# EAGLE design Smart_Lights_X1 (EAGLE 9.5.1)
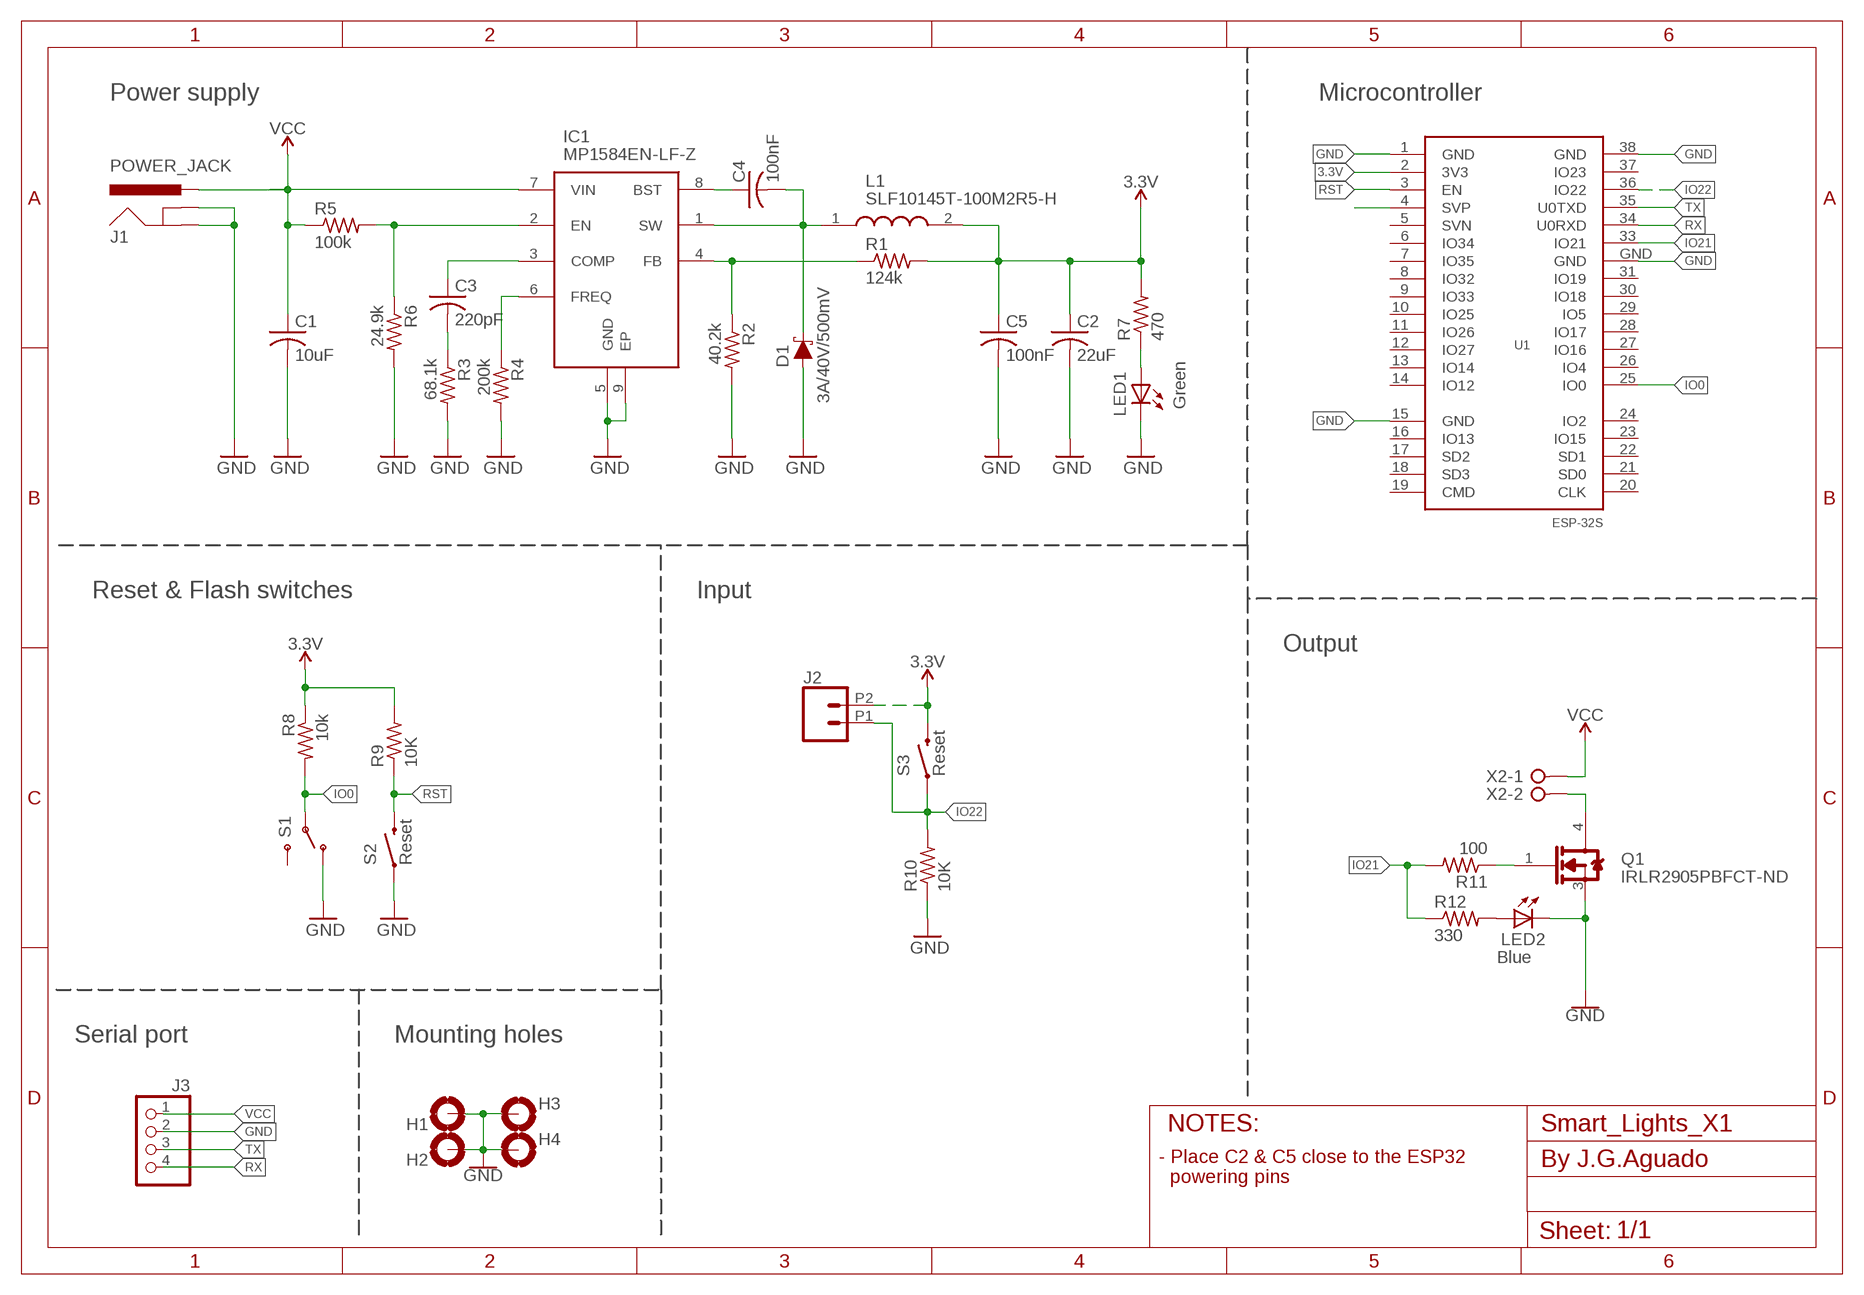
[diagram p0: schematic, sheet 1]

## Parts
C1  10uF  C-USC1206  [C1206]
C2  22uF  C-USC1206  [C1206]
C3  220pF  C-USC1206  [C1206]
C4  100nF  C-USC1206  [C1206]
C5  100nF  C-USC1206  [C1206]
D1  3A/40V/500mV  DIODE-SCHOTTKY-B340A  [SMA-DIODE]
H1  MOUNT-PAD-ROUND  [3,0-PAD]
H2  MOUNT-PAD-ROUND  [3,0-PAD]
H3  MOUNT-PAD-ROUND  [3,0-PAD]
H4  MOUNT-PAD-ROUND  [3,0-PAD]
IC1  MP1584EN-LF-Z  [SOIC127P600X170-9N]
J1  POWER_JACK  [POWER_JACK_PTH]
J2  CONN_022.54MM_SCREWTERM  [1X02_2.54_SCREWTERM]
J3  PINHD-1X4  [1X04]
L1  SLF10145T-100M2R5-H  [SLF10145]
LED1  Green  LED1206  [LED1206]
LED2  Blue  LED1206  [LED1206]
Q1  IRLR2905TRPBF  INFINEON_TECHNOLOGIES_IRLR2905TRPBFINFINEON_TECHNOLOGIES_IRLR2905TRPBF_0_0  [INFINEON_TECHNOLOGIES_IRLR2905TRPBF_0]
R1  124k  R-US_M1206  [M1206]
R2  40.2k  R-US_M1206  [M1206]
R3  68.1k  R-US_M1206  [M1206]
R4  200k  R-US_M1206  [M1206]
R5  100k  R-US_M1206  [M1206]
R6  24.9k  R-US_M1206  [M1206]
R7  470  R-US_M1206  [M1206]
R8  10k  R-US_M1206  [M1206]
R9  10K  R-US_M1206  [M1206]
R10  10K  R-US_M1206  [M1206]
R11  100  R-US_M1206  [M1206]
R12  330  R-US_M1206  [M1206]
S1  SWITCH_SPDT  [KPS-1290]
S2  Reset  SWITCH-MOMENTARY-2SMD-4  [TACTILE_SWITCH_TALL]
S3  Reset  SWITCH-MOMENTARY-2SMD-4  [TACTILE_SWITCH_TALL]
U1  ESP-32S  [ESP-32S]
X2  W237-02P  [W237-132]

## Nets
3.3V: C2.1 C5.1 J2.P2 L1.2 R1.2 R7.2 R8.1 R9.2 S3.B2 U1.2(3V3)
GND: C1.2 C2.2 C5.2 D1.A H1.B3,0(MOUNT) H1.P$2(MOUNT) H1.P$3(MOUNT) H1.P$4(MOUNT) H1.P$5(MOUNT) H1.P$6(MOUNT) H1.P$7(MOUNT) H1.P$8(MOUNT) H1.P$9(MOUNT) H2.B3,0(MOUNT) H2.P$2(MOUNT) H2.P$3(MOUNT) H2.P$4(MOUNT) H2.P$5(MOUNT) H2.P$6(MOUNT) H2.P$7(MOUNT) H2.P$8(MOUNT) H2.P$9(MOUNT) H3.B3,0(MOUNT) H3.P$2(MOUNT) H3.P$3(MOUNT) H3.P$4(MOUNT) H3.P$5(MOUNT) H3.P$6(MOUNT) H3.P$7(MOUNT) H3.P$8(MOUNT) H3.P$9(MOUNT) H4.B3,0(MOUNT) H4.P$2(MOUNT) H4.P$3(MOUNT) H4.P$4(MOUNT) H4.P$5(MOUNT) H4.P$6(MOUNT) H4.P$7(MOUNT) H4.P$8(MOUNT) H4.P$9(MOUNT) IC1.5(GND) IC1.9(EP) J1.GND J1.GNDBREAK J3.2 LED1.C LED2.C Q1.3(SOURCE) R2.2 R3.2 R4.2 R6.2 R10.1 S1.O S2.A2 U1.1(GND) U1.15(GND) U1.38(GND) U1.GND
IN_5: U1.4(SVP)
IO0: R8.2 S1.P U1.25(IO0)
IO21: R11.2 R12.1 U1.33(IO21)
IO22: J2.P1 R10.2 S3.A2 U1.36(IO22)
N$1: C4.1 IC1.8(BST)
N$2: C4.2 D1.C IC1.1(SW) L1.1
N$4: Q1.4(DRAIN) X2.2
N$5: Q1.1(GATE) R11.1
N$6: IC1.4(FB) R1.1 R2.1
N$7: C3.2 R3.1
N$8: C3.1 IC1.3(COMP)
N$12: IC1.6(FREQ) R4.1
N$13: IC1.2(EN) R5.2 R6.1
N$15: LED1.A R7.1
N$17: LED2.A R12.2
RST: R9.1 S2.B2 U1.3(EN)
RX: J3.4 U1.34(U0RXD)
TX: J3.3 U1.35(U0TXD)
VCC: C1.1 IC1.7(VIN) J1.PWR J3.1 R5.1 X2.1
Unconnected: S1.S U1.5(SVN) U1.6(IO34) U1.7(IO35) U1.8(IO32) U1.9(IO33) U1.10(IO25) U1.11(IO26) U1.12(IO27) U1.13(IO14) U1.14(IO12) U1.16(IO13) U1.17(SD2) U1.18(SD3) U1.19(CMD) U1.20(CLK) U1.21(SD0) U1.22(SD1) U1.23(IO15) U1.24(IO2) U1.26(IO4) U1.27(IO16) U1.28(IO17) U1.29(IO5) U1.30(IO18) U1.31(IO19) U1.37(IO23)

## Notes on the sheet
- Power supply | Microcontroller
- Reset & Flash switches | Input
- Output
- Serial port | Mounting holes
- - Place C2 & C5 close to the ESP32
    powering pins

## Library data of the parts
C1-C5 = rcl:C-US: CAPACITOR, American symbol; SPICEPREFIX: C
D1 = SparkFun-DiscreteSemi:DIODE-SCHOTTKY: Schottky diode A Schottky diode is a semiconductor diode which has a low forward voltage drop and a very fast switching action.; PROD_ID: DIO-09886
H1-H4 = SpaceDIY_connectors:MOUNT-PAD-ROUND: MOUNTING PAD, round
IC1 = SamacSys_Parts:MP1584EN-LF-Z: Switching Voltage Regulators 3A 1.5MHz 28V Nonsync Buck Source: Datasheet <https://componentsearchengine.com/Datasheets/1/MP1584EN-LF-Z.pdf>; DESCRIPTION: Switching Voltage Regulators 3A 1.5MHz 28V Nonsync Buck; HEIGHT: 1.7mm; MANUFACTURER_NAME: Monolithic Power Systems (MPS); MANUFACTURER_PART_NUMBER: MP1584EN-LF-Z; MOUSER_PART_NUMBER: 946-MP1584ENLFZ; MOUSER_PRICE-STOCK: https://www.mouser.co.uk/ProductDetail/Monolithic-Power-Systems-MPS/MP1584EN-LF-Z?qs=rC7bBWoQAAktQUA%2FYI26vA%3D%3D
J1 = SparkFun-Connectors:POWER_JACK: Power Jack Connector This is the standard 5.5mm barrel jack for power. The PTH is the most common, proven, reliable, footprint. The Slot footprint only works if the mill layer is transmitted to the PCB fab house so be warned. Here are the connectors we sell at SparkFun: DC Barrel Power Jack/Connector <https://www.sparkfun.com/products/119> (PRT-00119) DC Barrel Power Jack/Connector (SMD) <https://www.sparkfun.com/products/12748> (PRT-12748) DC Barrel Jack Adapter - Breadboard Compatible <https://www.sparkfun.com/products/10811> (PRT-10811) It is used on this SparkFun product (and many, many others): SparkFun RedBoard - Programmed with Arduino <https://www.sparkfun.com/products/12757> (DEV-12757) Also, if you need a mating power supply or connector, please check these out: Wall Adapter Power Supply - 9VDC 650mA <https://www.sparkfun.com/products/298> (TOL-00298) DC Barrel Jack Adapter - Male <https://www.sparkfun.com/products/10287> (PRT-10287); PROD_ID: CONN-08197
J2 = SparkFun-Connectors:CONN_02: Multi connection point. Often used as Generic Header-pin footprint for 0.1 inch spaced/style header connections On any of the 0.1 inch spaced packages, you can populate with these: Break Away Headers - Straight <https://www.sparkfun.com/products/116> (PRT-00116) Break Away Male Headers - Right Angle <https://www.sparkfun.com/products/553> (PRT-00553) Female Headers <https://www.sparkfun.com/products/115> (PRT-00115) Break Away Headers - Machine Pin <https://www.sparkfun.com/products/117> (PRT-00117) Break Away Female Headers - Swiss Machine Pin <https://www.sparkfun.com/products/743> (PRT-00743) For SCREWTERMINALS and SPRING TERMINALS visit here: Screw Terimnals on SparkFun.com <https://www.sparkfun.com/search/results?term=Screw+Terminals> (5mm/3.5mm/2.54mm spacing) This device is also useful as a general connection point to wire up your design to another part of your project. Our various solder wires solder well into these plated through hole pads. Hook-Up Wire - Assortment (Stranded, 22 AWG) <https://www.sparkfun.com/products/11375> (PRT-11375) Hook-Up Wire - Assortment (Solid Core, 22 AWG) <https://www.sparkfun.com/products/11367> (PRT-11367) View the entire wire category on our website here <https://www.sparkfun.com/categories/141> Special notes: Molex polarized connector foot print use with: PRT-08233 with associated crimp pins and housings. 2.54_SCREWTERM for use with PRT-10571. 3.5mm Screw Terminal footprints for PRT-08084 5mm Screw Terminal footprints for use with PRT-08432
J3 = pinhead:PINHD-1X4: PIN HEADER
L1 = SamacSys_Parts:SLF10145T-100M2R5-H: Inductors for power circuits, Wound ferrite, Automotive Source: Datasheet <https://product.tdk.com/system/files/dam/doc/product/inductor/inductor/smd/catalog/inductor_automotive_power_slf10145-h_en.pdf>; DESCRIPTION: Inductors for power circuits, Wound ferrite, Automotive; HEIGHT: mm; MANUFACTURER_NAME: TDK; MANUFACTURER_PART_NUMBER: SLF10145T-100M2R5-H; MOUSER_PART_NUMBER: 810-SLF10145T100M2R5; MOUSER_PRICE-STOCK: https://www.mouser.co.uk/ProductDetail/TDK/SLF10145T-100M2R5-H?qs=Ydpp5fRLlSHtCO7lbZYIxA%3D%3D
LED1 LED2 = SpaceDIY_passive_components:LED1206
Q1 = Infineon Technologies - IRLR2905TRPBF:INFINEON_TECHNOLOGIES_IRLR2905TRPBF: MOSFET N-CH 55V 42A DPAK; AUTOMOTIVE: No; CENTROID_NOT_SPECIFIED: Yes; CONTINUOUS_DRAIN_CURRENT: 42A; DATASHEET: https://www.infineon.com/dgdl/irlr2905pbf.pdf?fileId=5546d462533600a40153566cc2bb2679; DEPLETION_MODE: False; DEVICE_CLASS_L1: Discrete Semiconductors; DEVICE_CLASS_L2: Transistors; DEVICE_CLASS_L3: MOSFETs; DIGIKEY_DESCRIPTION: TRANS MOSFET N-CH 55V 42A DPAK; DIGIKEY_PART_NUMBER: IRLR2905PBFCT-ND; DRAIN_TO_SOURCE_BREAKDOWN_VOLTAGE: 55V; DRAIN_TO_SOURCE_RESISTANCE: 0.03Ω; DRAIN_TO_SOURCE_VOLTAGE: 55V; FOOTPRINT_URL: http://www.irf.com/package/hexfet/dpakfootprint.pdf; FOOTPRINT_VARIANT_NAME_0: Recommended_Land_Pattern; GATE_CHARGE_AT_VGS: 48nC @ 5V; GATE_TO_SOURCE_VOLTAGE: 16V; HEIGHT: 2.52mm; INPUT_CAPACITACE_AT_VDS: 1700pF @ 25V; LEAD_FREE: Yes; MAX_FORWARD_DIODE_VOLTAGE: 1.3V; MAX_JUNCTION_TEMP: +175°C; MF: Infineon Technologies; MFG_PACKAGE_IDENT: PG-TO252-3; MFG_PACKAGE_IDENT_DATE: 0; MFG_PACKAGE_IDENT_REV: 901; MOUSER_PART_NUMBER: 942-IRLR2905TRPBF; MPN: IRLR2905TRPBF; NUMBER_OF_CHANNELS: 1; NUMBER_OF_N_CHANNELS: 1; PACKAGE: D-Pak; POWER_DISSIPATION: 110W; PREFIX: Q; PULSE_DRAIN_CURRENT: 160A; REVERSE_RECOVERY_CHARGE: 210nC; REVERSE_RECOVERY_TIME: 80ns; ROHS: Yes; RTHJA_MAX: 110°C/W; TEMPERATURE_RANGE_HIGH: +175°C; TEMPERATURE_RANGE_LOW: -55°C; THRESHOLD_VGS_MAX: 2V; THRESHOLD_VGS_MIN: 1V; TURN_OFF_DELAY_TIME: 26ns; TURN_ON_DELAY_TIME: 11ns; VERIFICATION_VERSION: 0.0.0.3
R1-R12 = rcl:R-US_: RESISTOR, American symbol; SPICEPREFIX: R
S1 = SparkFun-Retired:SWITCH_SPDT: SWCH-10651 Side-actuated SPDT slide switch, as used on the Arduino Pro; PROD_ID: SWCH-10651
S2 S3 = Testing:SWITCH-MOMENTARY-2: Various NO switches- pushbuttons, reed, etc
U1 = esp32:ESP-32S: Ai-Thinker ESP-32S
X2 = con-wago-508:W237-02P: WAGO SREW CLAMP; OC_FARNELL: unknown; OC_NEWARK: unknown

## Net classes
0 default: clearance 0.205 mm
2 analog: width 0.203 mm, drill 0.33 mm, clearance 0.152 mm

## Board
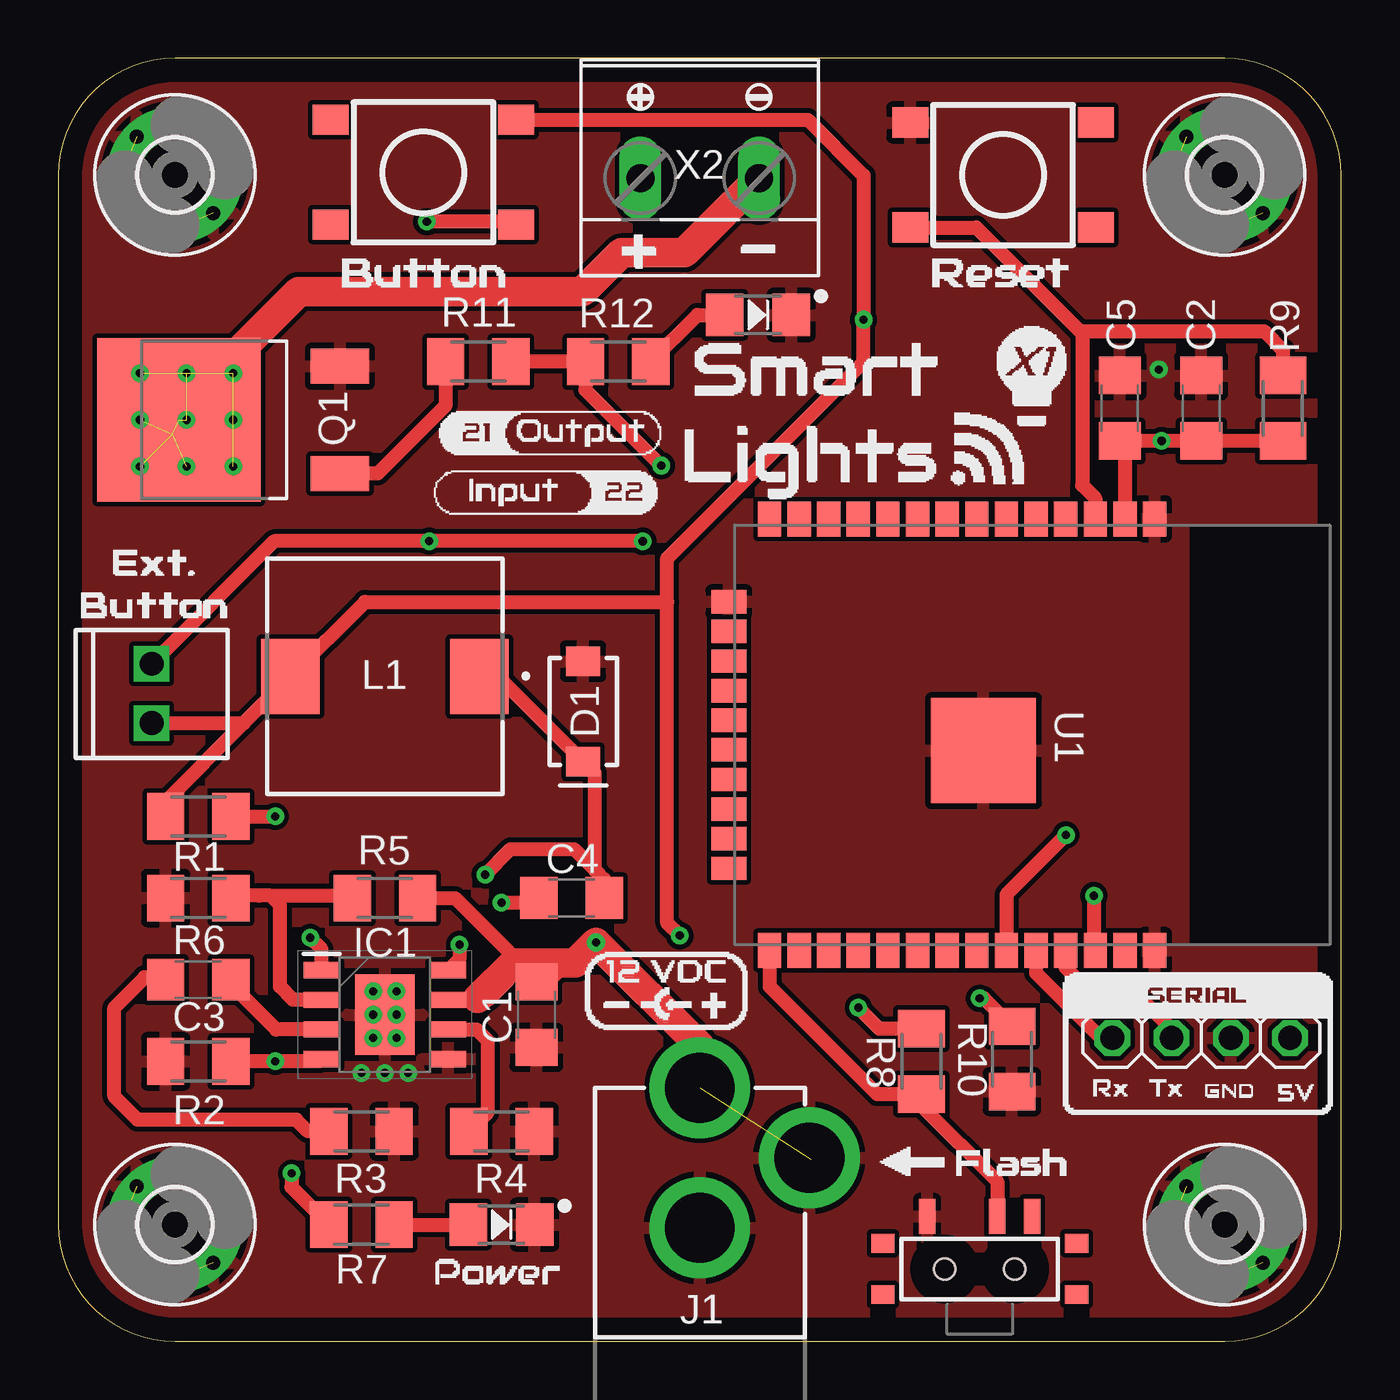
[diagram p1: board, top side]
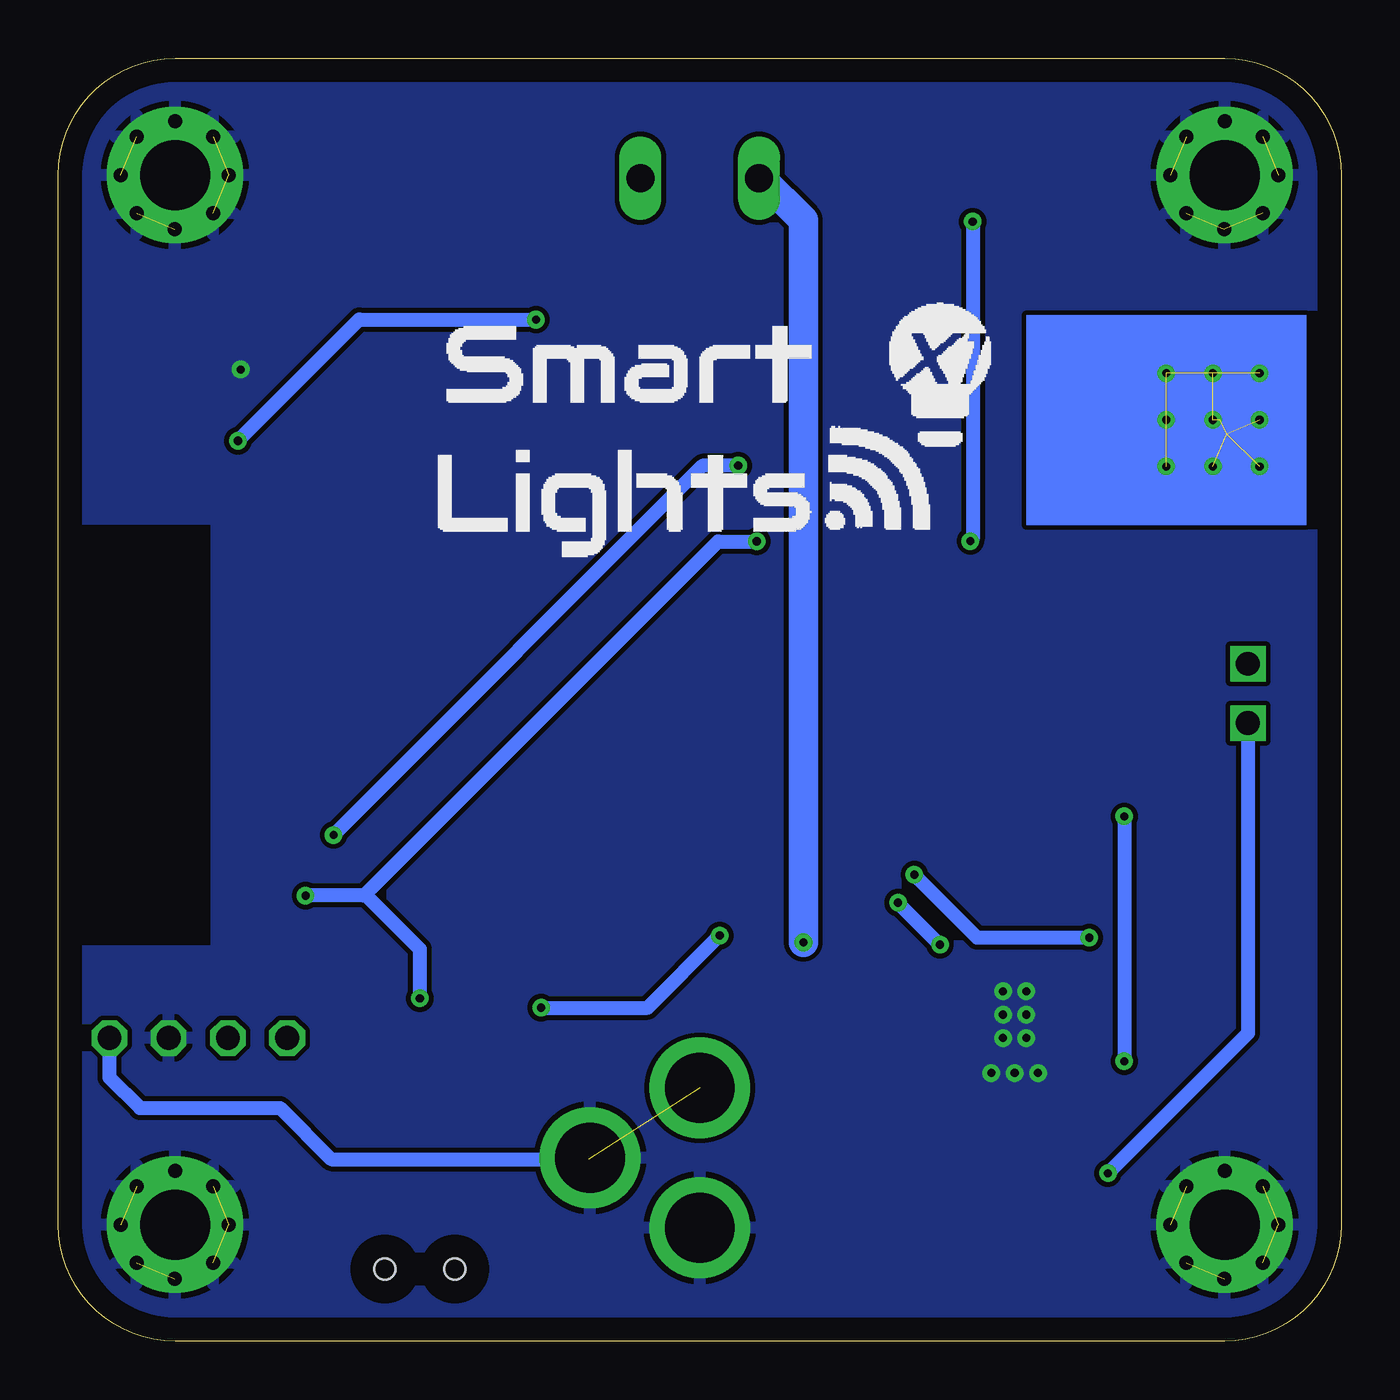
[diagram p2: board, bottom side, seen from below]

Size 55 x 55 mm. Coordinates in mm from the lower left corner, seen from the top.
Outline: 0,5 arc90 5,0 50,0 arc90 55,5 55,50 arc90 50,55 5,55 arc90 0,50 0,5
Copper layers (1*16): Top 0.035mm / dielectric 1.5mm / Bottom 0.035mm
Design rules "default": minimum track width 6mil, minimum drill 0.35mm, track to track 6mil, track to pad 6mil, pad to pad 6mil, via to via 6mil, smd to smd 6mil, copper to edge 40mil, drill to drill 6mil, minimum pad ring 10mil, minimum via ring 8mil, stop-mask expansion 4mil, vias tented up to drill 0mil, thermal gap 10mil

### Footprints (pad centres in the part's own frame; a part is rotated, then mirrored left to right if it is on the bottom)
C1206 = smd 1.6 x 1.8: 1 -1.4,0; 2 1.4,0
SMA-DIODE = smd 1.27 x 1.47: A -2.15,0; C 2.15,0
3,0-PAD = drill 3 pad 5.842: B3,0 0,0 | drill 0.6: P$2 0,2.31; P$3 1.638,1.634; P$4 2.318,-0.003; P$5 1.642,-1.64; P$6 0.005,-2.32; P$7 -1.633,-1.644; P$8 -2.313,-0.008; P$9 -1.636,1.63
SOIC127P600X170-9N = smd 1.525 x 0.7: 1 -2.712,1.905; 2 -2.712,0.635; 3 -2.712,-0.635; 4 -2.712,-1.905; 5 2.712,-1.905; 6 2.712,-0.635; 7 2.712,0.635; 8 2.712,1.905 | smd 2.56 x 3.45: 9 0,0
POWER_JACK_PTH = drill 2.997 pad 4.318: GND 0,7.7; GNDBREAK 4.7,10.7; PWR 0,13.7
1X02_2.54_SCREWTERM = drill 1.016 square: P1 2.54,0; P2 0,0
1X04 = drill 1.016 octagon: 1 -3.81,0; 2 -1.27,0; 3 1.27,0; 4 3.81,0
SLF10145 = smd 2.5 x 3.2: 1 -4.05,0; 2 4.05,0
LED1206 = smd 1.6 x 1.803: A -1.422,0; C 1.422,0
INFINEON_TECHNOLOGIES_IRLR2905TRPBF_0 = smd 1.5 x 2.5: 1 -2.3,-4.575; 3 2.3,-4.575 | smd 7 x 7: 4 0,2.325
M1206 = smd 1.6 x 2: 1 -1.4,0; 2 1.4,0
KPS-1290 = smd 0.7 x 1.5: O -2.25,2.25; P 0.75,2.25; S 2.25,2.25 | smd 1 x 0.8: P$1 -4.15,1.1; P$2 -4.15,-1.1; P$3 4.15,-1.1; P$4 4.15,1.1 | hole 0.9: -1.5,0; 1.5,0
TACTILE_SWITCH_TALL = smd 1.55 x 1.3: A1 -3.975,-2.25; A2 3.975,-2.25; B1 -3.975,2.25; B2 3.975,2.25
ESP-32S = smd 1.5 x 1: 1 -9.25,7; 2 -9.25,5.73; 3 -9.25,4.46; 4 -9.25,3.19; 5 -9.25,1.92; 6 -9.25,0.65; 7 -9.25,-0.62; 8 -9.25,-1.89; 9 -9.25,-3.16; 10 -9.25,-4.43; 11 -9.25,-5.7; 12 -9.25,-6.97; 13 -9.25,-8.24; 14 -9.25,-9.51; 25 9.25,-9.51; 26 9.25,-8.24; 27 9.25,-6.97; 28 9.25,-5.7; 29 9.25,-4.43; 30 9.25,-3.16; 31 9.25,-1.89; 32 9.25,-0.62; 33 9.25,0.65; 34 9.25,1.92; 35 9.25,3.19; 36 9.25,4.46; 37 9.25,5.73; 38 9.25,7 | smd 1 x 1.5: 15 -5.7,-11.25; 16 -4.43,-11.25; 17 -3.16,-11.25; 18 -1.89,-11.25; 19 -0.62,-11.25; 20 0.65,-11.25; 21 1.92,-11.25; 22 3.19,-11.25; 23 4.46,-11.25; 24 5.73,-11.25 | smd 4.5 x 4.5: GND 0.68,-0.33
W237-132 = drill 1.194 long: 1 -2.54,-0.635; 2 2.54,-0.635

### Placement (x,y rotation side)
C1  20.5,14 270 top
C2  49,40 90 top
C3  6,15.5 180 top
C4  22,19 0 top
C5  45.5,40 90 top
D1  22.5,27 270 top
H1  5,5 0 top
H2  5,50 0 top
H3  50,5 0 top
H4  50,50 0 top
IC1  14,14 0 top
J1  27.5,-2.84 0 top
J2  4,26.5 90 top
J3  49,13 180 top
L1  14,28.5 180 top
LED1  19,5 0 top
LED2  30,44 0 top
Q1  7.5,39.5 90 top
R1  6,22.5 180 top
R2  6,12 180 top
R3  13,9 0 top
R4  19,9 0 top
R5  14,19 180 top
R6  6,19 180 top
R7  13,5 180 top
R8  37,12 270 top
R9  52.5,40 270 top
R10  40.89,12.1 90 top
R11  18,42 0 top
R12  24,42 0 top
S1  39.5,3.1 0 top
S2  40.5,50 180 top
S3  15.66,50.11 0 top
U1  40,26 270 top
X2  27.5,50.5 0 top

### Tracks (layer width: path | path; a pad name or v marks a point on that pad's centre or on a via)
3.3V  (via drill 0.35)
  Top 0.61: 7.95,26.5 L1.2 13.15,31.7 26.1,31.7 | v10,7.2 10,6.6 R7.2 | R8.1 35.2,13.4 v34.3,14.3 | v26.65,17.39 26.1,17.94 26.1,31.7 | 26.1,31.7 26.1,33.56 34.52,41.98 v34.52,43.8 34.52,49.98 32.14,52.36 S3.B2 | U1.2 45.73,38.37 C5.1 v47.3,38.6 C2.1 R9.2 | R1.2 4.6,23.15 7.95,26.5 | J2.P2 7.95,26.5
  Bottom 0.61: J2.P2 4,13.2 v10,7.2 | v34.3,14.3 29.74,14.3 v26.65,17.39 | v47.3,38.6 42.1,43.8 v34.52,43.8
GND  (via drill 0.35)  (16 unrouted)
  other vias: 13.5,15 14.5,15 13.5,14 14.5,14 13.5,13 14.5,13 13,11.5 14,11.5 15,11.5 47.18,41.66
  pour Top: 5,55 arc90 0,50 0,5 arc90 5,0 50,0 arc90 55,5 55,50 arc90 50,55
  pour Bottom: 5,55 arc90 0,50 0,5 arc90 5,0 50,0 arc90 55,5 55,50 arc90 50,55
IO0
  Top 0.61: S1.P 40.25,6.85 37,10.1 R8.2 35.1,10.6 30.49,15.21 U1.25
IO21  (via drill 0.35)
  Top 0.61: v43.2,21.7 40.65,19.15 U1.33 | R11.2 R12.1 22.6,40.78 v25.85,37.54
  Bottom 0.61: v25.85,37.54 27.37,37.54 43.2,21.71 v43.2,21.7
IO22  (via drill 0.35)
  Top 0.61: J2.P1 9.26,34.3 v15.9,34.3 v25.05,34.3 v25.05,34.29 | v44.4,19.1 44.4,16.81 U1.36 | R10.2 39.69,14.7 v39.5,14.7 | S3.A2 19.5,48 v15.8,48
  Bottom 0.61: 41.9,19.1 41.8,19.1 39.5,16.8 v39.5,14.7 | 41.9,19.1 v44.4,19.1 | v25.05,34.29 26.71,34.29 41.9,19.1 | v15.8,48 15.8,34.4 v15.9,34.3
N$1  (via drill 0.35)
  Top 0.61: C4.1 20.4,18.8 v19,18.8 | v17.2,17 17.2,16.39 IC1.8
  Bottom 0.61: v19,18.8 v17.2,17
N$2  (via drill 0.35)
  Top 0.61: IC1.1 11.29,16.81 v10.8,17.3 | v18.3,20 19.4,21.1 22.1,21.1 23,20.2 | 23,20.2 23.4,19.8 C4.2 | 23,20.2 23,24.35 D1.C 18.85,28.5 L1.1
  Bottom 0.61: v10.8,17.3 15.6,17.3 v18.3,20
N$4  (via drill 0.35)  (10 unrouted)
  Top 1.27: X2.2 26.84,46.66 24.14,46.66 22.48,45 10.3,45 4.9,39.6 4.9,38.9
  other vias: 3.5,41.5 3.5,39.5 3.5,37.5 5.5,37.5 7.5,37.5 7.5,39.5 7.5,41.5 5.5,41.5 5.5,39.5
N$5
  Top 0.61: R11.1 16.6,40.1 13.7,37.2 Q1.1
N$6  (via drill 0.35)
  Top 0.61: IC1.4 11.19,12 v9.3,12 R2.1 | R1.1 v9.3,22.5
  Bottom 0.61: v9.3,22.5 v9.3,12
N$7
  Top 0.61: R3.1 10.7,9 10.2,9.5 3.4,9.5 2.4,10.5 2.4,14.3 3.7,15.6 4.5,15.6 C3.2
N$8
  Top 0.61: IC1.3 9.34,13.37 7.4,15.3 C3.1
N$12
  Top 0.61: IC1.6 17.93,13.37 18.4,12.9 18.4,9.8 R4.1
N$13
  Top 0.61: IC1.2 10.06,14.63 9.5,15.2 9.5,18.7 9.1,19.1 | 9.1,19.1 8.6,19.1 7.5,19.1 R6.1 | 9.1,19.1 12.5,19.1 R5.2
N$15
  Top 0.61: R7.1 LED1.A
N$17
  Top 0.61: R12.2 27.4,44 LED2.A
RST
  Top 0.61: S2.B2 39.35,47.75 43.8,43.3 | 43.8,43.3 43.9,43.2 43.9,36.7 44.46,36.14 U1.3 | 43.8,43.3 51.7,43.3 52.5,42.5 R9.1
RX
  Top 0.61: U1.34 41.92,15.78 44.7,13 J3.4
TX
  Top 0.61: U1.35 43.19,16.01 44.8,14.4 46.7,14.4 47.73,13.37 J3.3
VCC  (via drill 0.35)  (1 unrouted)
  Top 0.61: IC1.7 18.43,14.63 18.5,14.7 | 17.98,14.7 18.5,14.7 | 19.3,16.23 20.6,16.23 | 18.5,14.7 19.3,15.5 19.3,16.23 | R5.1 17,19 19.3,16.7 19.3,16.23
  Top 1.27: C1.1 21.33,16.23 20.6,16.23 | 17.98,14.7 19.51,16.23 22.18,16.23 v23.05,17.1 27.5,12.65 J1.PWR
  Bottom 0.61: J3.1 52.81,11.31 51.5,10 45.5,10 43.3,7.8 32.26,7.8
  Bottom 1.27: v23.05,17.1 23.05,48.05 24.86,49.87 X2.1
(copper drawn outside any net)
  shapes: Bottom area x1